# Altium schematic sheet Power.SchDoc
size A3; DocumentNumber: 7; SheetNumber: 7
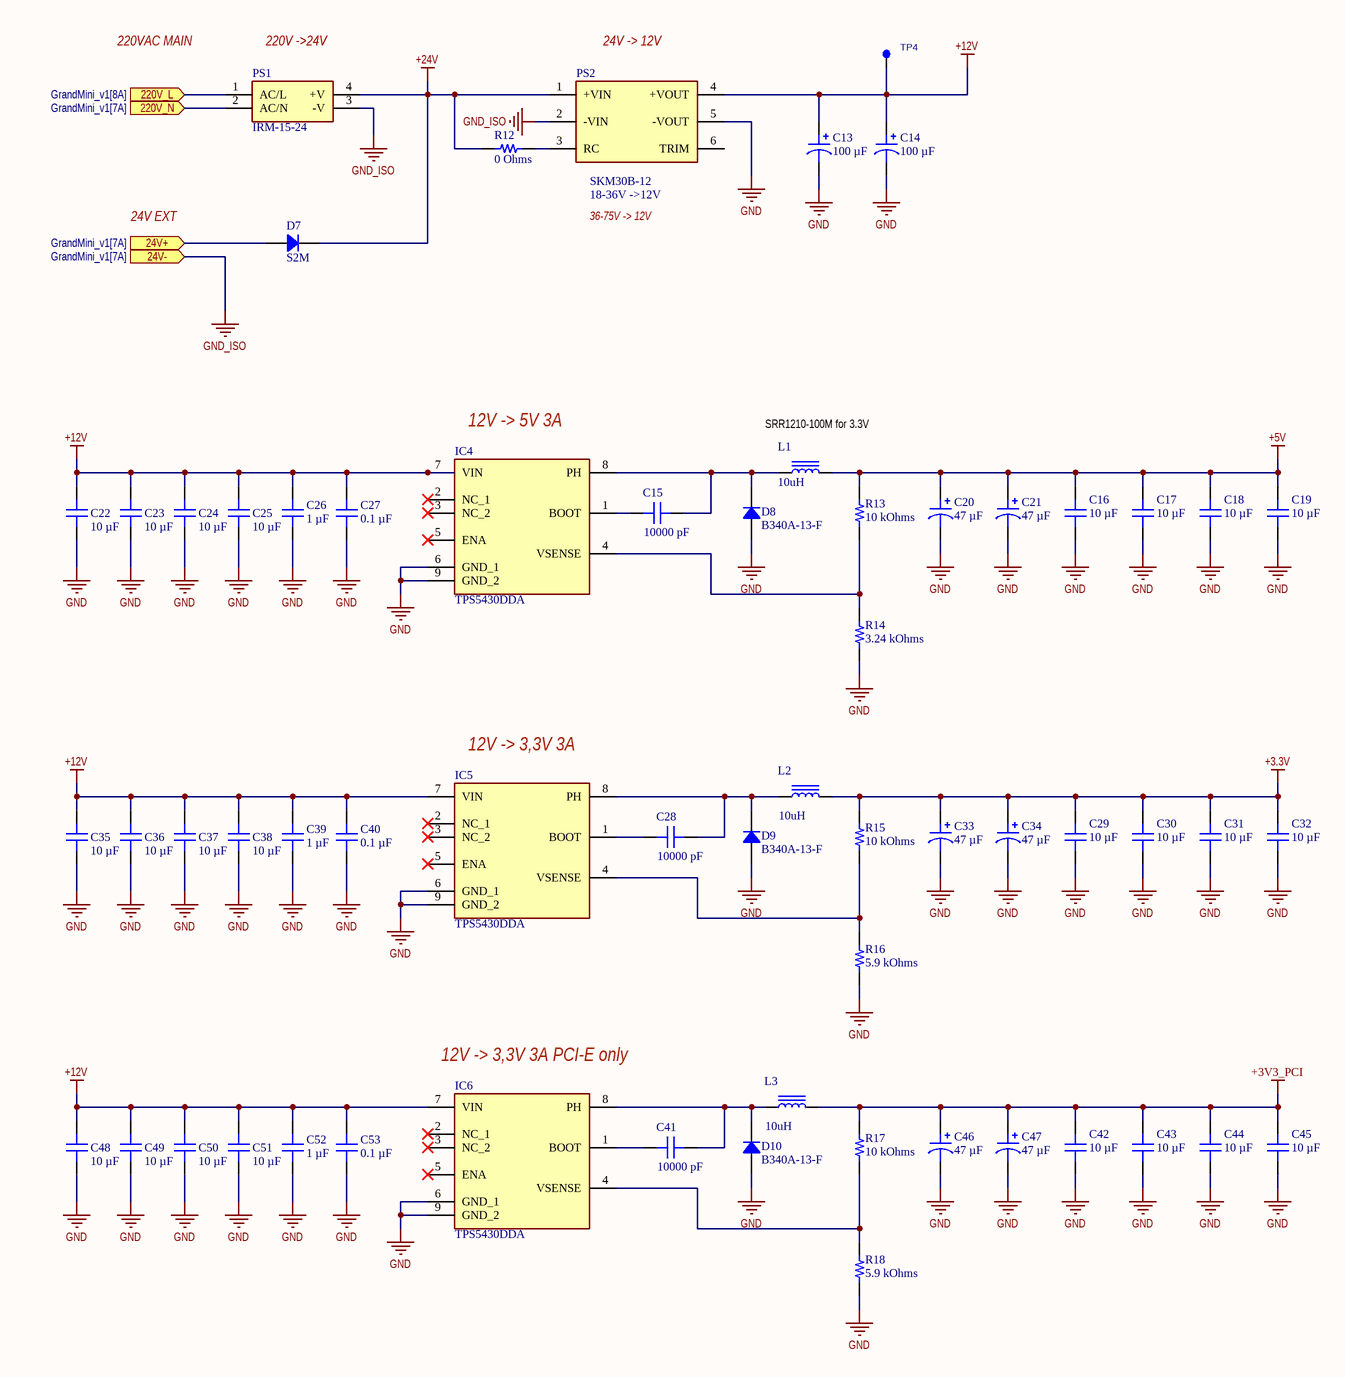
[diagram p0: Power.SchDoc]

## Parts
C13  100 µF  [CAP ALSMD 8.3MM H10.5MM]
C14  100 µF  [CAP ALSMD 8.3MM H10.5MM]
C15  10000 pF  [CAP 0603_1608]
C16  10 µF  [CAP 0805_2012]
C17  10 µF  [CAP 0805_2012]
C18  10 µF  [CAP 0805_2012]
C19  10 µF  [CAP 0805_2012]
C20  47 µF  [CAP POL 2917_7343]
C21  47 µF  [CAP POL 2917_7343]
C22  10 µF  [CAP 0805_2012]
C23  10 µF  [CAP 0805_2012]
C24  10 µF  [CAP 0805_2012]
C25  10 µF  [CAP 0805_2012]
C26  1 µF  [CAP 0603_1608]
C27  0.1 µF  [CAP 0603_1608]
C28  10000 pF  [CAP 0603_1608]
C29  10 µF  [CAP 0805_2012]
C30  10 µF  [CAP 0805_2012]
C31  10 µF  [CAP 0805_2012]
C32  10 µF  [CAP 0805_2012]
C33  47 µF  [CAP POL 2917_7343]
C34  47 µF  [CAP POL 2917_7343]
C35  10 µF  [CAP 0805_2012]
C36  10 µF  [CAP 0805_2012]
C37  10 µF  [CAP 0805_2012]
C38  10 µF  [CAP 0805_2012]
C39  1 µF  [CAP 0603_1608]
C40  0.1 µF  [CAP 0603_1608]
C41  10000 pF  [CAP 0603_1608]
C42  10 µF  [CAP 0805_2012]
C43  10 µF  [CAP 0805_2012]
C44  10 µF  [CAP 0805_2012]
C45  10 µF  [CAP 0805_2012]
C46  47 µF  [CAP POL 2917_7343]
C47  47 µF  [CAP POL 2917_7343]
C48  10 µF  [CAP 0805_2012]
C49  10 µF  [CAP 0805_2012]
C50  10 µF  [CAP 0805_2012]
C51  10 µF  [CAP 0805_2012]
C52  1 µF  [CAP 0603_1608]
C53  0.1 µF  [CAP 0603_1608]
D7  S2M  [DO214AA SMB]
D8  B340A-13-F  [DO214AC SMA]
D9  B340A-13-F  [DO214AC SMA]
D10  B340A-13-F  [DO214AC SMA]
IC4  TPS5430DDA  [SOIC127P600X170-9N]
IC5  TPS5430DDA  [SOIC127P600X170-9N]
IC6  TPS5430DDA  [SOIC127P600X170-9N]
L1  10uH  [XAL6060-103MEB]
L2  10uH  [XAL6060-103MEB]
L3  10uH  [XAL6060-103MEB]
PS1  IRM-15-24  [IRM-15]
PS2  18-36V ->12V  [SKM30]
R12  0 Ohms  [YAGEO RES 0603_1608]
R13  10 kOhms  [YAGEO RES 0603_1608]
R14  3.24 kOhms  [YAGEO RES 0603_1608]
R15  10 kOhms  [YAGEO RES 0603_1608]
R16  5.9 kOhms  [YAGEO RES 0603_1608]
R17  10 kOhms  [YAGEO RES 0603_1608]
R18  5.9 kOhms  [YAGEO RES 0603_1608]
TP4  PAD_TEST  [PAD_TEST]  (value not drawn)  (no BOM)

## Ports
24V+ (in, see GrandMini_v1[7A]), 24V- (in, see GrandMini_v1[7A]), 220V_L (in, see GrandMini_v1[8A]), 220V_N (in, see GrandMini_v1[7A])

## Nets
+3.3V: C29.2 C30.2 C31.2 C32.2 C33.1 C34.1 L2.2 R15.2
+3V3_PCI: C42.2 C43.2 C44.2 C45.2 C46.1 C47.1 L3.2 R17.2
+5V: C16.2 C17.2 C18.2 C19.2 C20.1 C21.1 L1.2 R13.2
+12V: C13.1 C14.1 C22.2 C23.2 C24.2 C25.2 C26.2 C27.2 C35.2 C36.2 C37.2 C38.2 C39.2 C40.2 C48.2 C49.2 C50.2 C51.2 C52.2 C53.2 IC4.7(VIN) IC5.7(VIN) IC6.7(VIN) PS2.4(+VOUT) TP4.1
+24V: D7.2 PS1.4(+V) PS2.1(+VIN) R12.1
GND: C13.2 C14.2 C16.1 C17.1 C18.1 C19.1 C20.2 C21.2 C22.1 C23.1 C24.1 C25.1 C26.1 C27.1 C29.1 C30.1 C31.1 C32.1 C33.2 C34.2 C35.1 C36.1 C37.1 C38.1 C39.1 C40.1 C42.1 C43.1 C44.1 C45.1 C46.2 C47.2 C48.1 C49.1 C50.1 C51.1 C52.1 C53.1 D8.1 D9.1 D10.1 IC4.6(GND_1) IC4.9(GND_2) IC5.6(GND_1) IC5.9(GND_2) IC6.6(GND_1) IC6.9(GND_2) PS2.5(-VOUT) R14.1 R16.1 R18.1
GND_ISO: PS1.3(-V) PS2.2(-VIN) ; port 24V-
24V+: D7.1 ; port 24V+
220V_L: PS1.1(AC/L) ; port 220V_L
220V_N: PS1.2(AC/N) ; port 220V_N
NetC15_1: C15.1 D8.2 IC4.8(PH) L1.1
NetC15_2: C15.2 IC4.1(BOOT)
NetC28_1: C28.1 D9.2 IC5.8(PH) L2.1
NetC28_2: C28.2 IC5.1(BOOT)
NetC41_1: C41.1 D10.2 IC6.8(PH) L3.1
NetC41_2: C41.2 IC6.1(BOOT)
NetIC4_4: IC4.4(VSENSE) R13.1 R14.2
NetIC5_4: IC5.4(VSENSE) R15.1 R16.2
NetIC6_4: IC6.4(VSENSE) R17.1 R18.2
NetPS2_3: PS2.3(RC) R12.2

Not connected (* = marked no-connect by the designer): IC4 2(NC_1)* 3(NC_2)* 5(ENA)*; IC5 2(NC_1)* 3(NC_2)* 5(ENA)*; IC6 2(NC_1)* 3(NC_2)* 5(ENA)*; PS2 6(TRIM)

## Notes on the sheet
- 220VAC MAIN
- (near PS1) 220V ->24V
- (near PS2) 24V -> 12V
- 24V EXT
- 36-75V -> 12V
- (near IC4) 12V -> 5V 3A
- (near L1) SRR1210-100M for 3.3V
- (near IC5) 12V -> 3,3V 3A
- (near IC6) 12V -> 3,3V 3A PCI-E only
- 1
- 2
- 3
- 4
- 5
- 6
- A
- B
- C
- www.raspberrypi.com <http://www.raspberrypi.com>
- D
- Title: Compute Module 4 IO Board - PSUs
- File: PSUs.kicad_sch
- Sheet: /
- © 2020-2022 Raspberry Pi Ltd (formerly Raspberry Pi (Trading) Ltd.)
- KiCad E.D.A.  kicad (5.1.4)-1
- Size: A4
- Date:
- Rev:
- Id: 1/1

## Library data of the parts
C13 C14 = EEE-FP1V101AL: CAP ALUM 100UF 20% 35V SMD; manufacturer: Panasonic Electronic Components; ESR (Equivalent Series Resistance): 80mOhm @ 100kHz; Lifetime @ Temp.: 2000 Hrs @ 105°C; Polarization: Polar; Ripple Current @ High Frequency: 850 mA @ 100 kHz; Ripple Current @ Low Frequency: 552.5 mA @ 120 Hz; Surface Mount Land Size: 0.327" L x 0.327" W (8.30mm x 8.30mm); Part Number: EEE-FP1V101AL; Applications: Automotive; Capacitance: 100 µF; componentlink1description: Datasheet; componentlink1url: https://na.industrial.panasonic.com/file-download/19633; componentlink2description: DigiKey Link; componentlink2url: https://www.digikey.com/en/products/detail/panasonic-electronic-components/EEE-FP1V101AL/12459641; Height - Seated (Max): 0.413" (10.50mm); lastupdated: 03.06.2024 20:15:43; Lifecycle Status: Active; Minimum Order: 1; Mounting Type: Surface Mount; Operating Temperature: -55°C ~ 105°C; packaging: TapeAndReel; partid: 27835; Part Status: Active; price: 0.28; Ratings: AEC-Q200; series: FP, Halogen Free; Size / Dimension: 0.315" Dia (8.00mm); Supplier 1: DigiKey; Supplier Part Number 1: 10-EEE-FP1V101ALCT-ND; Tolerance: ±20%; value: 100 µF; Voltage - Rated: 35 V
C15 C28 C41 = CC0603JRX7R9BB103: CAP CER 10000PF 50V X7R 0603; manufacturer: Yageo; Tolerance: ±5%; Supplier 1: DigiKey; Capacitance: 10000 pF; packaging: TapeAndReel; componentlink1url: https://www.yageo.com/upload/media/product/productsearch/datasheet/mlcc/UPY-GPHC_X7R_6.3V-to-50V_18.pdf; componentlink1description: Datasheet; componentlink2url: https://www.digikey.com/en/products/detail/yageo/CC0603JRX7R9BB103/5195187; componentlink2description: DigiKey Link; Supplier Part Number 1: 311-1778-1-ND; Part Number: CC0603JRX7R9BB103; Value: 10000 pF; Applications: General Purpose; Device Package: 0603 (1608 Metric); lastupdated: 09.02.2024 20:10:26; Lifecycle Status: Active; Minimum Order: 1; Mounting Type: Surface Mount, MLCC; Operating Temperature: -55°C ~ 125°C; Package / Case: 0603 (1608 Metric); partid: 5230; Part Status: Active; price: 0.01; series: CC; Size / Dimension: 0.063" L x 0.031" W (1.60mm x 0.80mm); Temperature Coefficient: X7R; Thickness (Max): 0.035" (0.90mm); Voltage - Rated: 50V
C16-C19 C22-C25 C29-C32 C35-C38 C42-C45 C48-C51 = CC0805KKX5R8BB106: CAP CER 10UF 25V X5R 0805; manufacturer: Yageo; Tolerance: ±10%; Value: 10 µF; Part Number: CC0805KKX5R8BB106; Applications: General Purpose; Capacitance: 10 µF; componentlink1description: Datasheet; componentlink1url: https://www.yageo.com/upload/media/product/productsearch/datasheet/mlcc/UPY-GPHC_X5R_4V-to-50V_25.pdf; componentlink2description: DigiKey Link; componentlink2url: https://www.digikey.com/en/products/detail/yageo/CC0805KKX5R8BB106/5195275; Device Package: 0805 (2012 Metric); lastupdated: 09.02.2024 20:15:28; Lifecycle Status: Active; Minimum Order: 1; Mounting Type: Surface Mount, MLCC; Operating Temperature: -55°C ~ 85°C; Package / Case: 0805 (2012 Metric); packaging: TapeAndReel; partid: 16151; Part Status: Active; price: 0.06; series: CC; Size / Dimension: 0.079" L x 0.049" W (2.00mm x 1.25mm); Supplier 1: DigiKey; Supplier Part Number 1: 311-1869-1-ND; Temperature Coefficient: X5R; Thickness (Max): 0.057" (1.45mm); Voltage - Rated: 25V
C20 C21 C33 C34 C46 C47 = T491X476K035AT: CAP TANT 47UF 10% 35V 2917; manufacturer: KEMET; Manufacturer Size Code: X; ESR (Equivalent Series Resistance): 600mOhm; Lifetime @ Temp.: 2000 Hrs @ 125°C; Type: Molded; Part Number: T491X476K035AT; Value: 47 µF; Capacitance: 47 µF; componentlink1description: Datasheet; componentlink1url: https://api.kemet.com/component-edge/download/datasheet/T491X476K035AT.pdf; componentlink2description: DigiKey Link; componentlink2url: https://www.digikey.com/en/products/detail/kemet/T491X476K035AT/818681; Device Package: 2917 (7343 Metric); Features: General Purpose; Height - Seated (Max): 0.169" (4.30mm); lastupdated: 03.06.2024 19:30:20; Lifecycle Status: Active; Minimum Order: 1; Mounting Type: Surface Mount; Operating Temperature: -55°C ~ 125°C; Package / Case: 2917 (7343 Metric); packaging: TapeAndReel; partid: 3168; Part Status: Active; price: 1.10; series: T491; Size / Dimension: 0.287" L x 0.169" W (7.30mm x 4.30mm); Supplier 1: DigiKey; Supplier Part Number 1: 399-3821-1-ND; Tolerance: ±10%; Voltage - Rated: 35 V
C26 C39 C52 = CC0603KRX7R9BB105: CAP CER 1UF 50V X7R 0603; manufacturer: Yageo; Tolerance: ±10%; Part Number: CC0603KRX7R9BB105; Value: 1 µF; Applications: General Purpose; Capacitance: 1 µF; componentlink1description: Datasheet; componentlink1url: https://www.yageo.com/upload/media/product/productsearch/datasheet/mlcc/UPY-GPHC_X7R_6.3V-to-50V_20.pdf; componentlink2description: DigiKey Link; componentlink2url: https://www.digikey.com/en/products/detail/yageo/CC0603KRX7R9BB105/5883796; Device Package: 0603 (1608 Metric); lastupdated: 09.02.2024 20:09:49; Lifecycle Status: Active; Minimum Order: 1; Mounting Type: Surface Mount, MLCC; Operating Temperature: -55°C ~ 125°C; Package / Case: 0603 (1608 Metric); packaging: TapeAndReel; partid: 45844; Part Status: Active; price: 0.09; series: CC; Size / Dimension: 0.063" L x 0.031" W (1.60mm x 0.80mm); Supplier 1: DigiKey; Supplier Part Number 1: 311-2082-1-ND; Temperature Coefficient: X7R; Thickness (Max): 0.035" (0.90mm); Voltage - Rated: 50V
C27 C40 C53 = CC0603KRX7R9BB104: CAP CER 0.1UF 50V X7R 0603; manufacturer: Yageo; Tolerance: ±10%; Part Number: CC0603KRX7R9BB104; Value: 0.1 µF; Applications: General Purpose; Capacitance: 0.1 µF; componentlink1description: Datasheet; componentlink1url: https://www.yageo.com/upload/media/product/productsearch/datasheet/mlcc/UPY-GPHC_X7R_6.3V-to-50V_18.pdf; componentlink2description: DigiKey Link; componentlink2url: https://www.digikey.com/en/products/detail/yageo/CC0603KRX7R9BB104/2103082; Device Package: 0603 (1608 Metric); lastupdated: 09.02.2024 20:10:21; Lifecycle Status: Active; Minimum Order: 1; Mounting Type: Surface Mount, MLCC; Operating Temperature: -55°C ~ 125°C; Package / Case: 0603 (1608 Metric); packaging: TapeAndReel; partid: 9506; Part Status: Active; price: 0.01; series: CC; Size / Dimension: 0.063" L x 0.031" W (1.60mm x 0.80mm); Supplier 1: DigiKey; Supplier Part Number 1: 311-1344-1-ND; Temperature Coefficient: X7R; Thickness (Max): 0.035" (0.90mm); Voltage - Rated: 50V
D7 = S2M: DIODE GEN PURP 1KV 2A DO214AA; Manufacturer: ON Semiconductor; Capacitance @ Vr, F: 30pF @ 4V, 1MHz; Current - Reverse Leakage @ Vr: 1µA @ 1000V; Diode Type: Standard; Reverse Recovery Time (trr): 2µs; Speed: Standard Recovery >500ns, > 200mA (Io); Voltage - DC Reverse (Vr) (Max): 1000V; Voltage - Forward (Vf) (Max) @ If: 1.15V @ 2A; Part Number: S2M; ComponentLink1Description: Datasheet; ComponentLink1URL: https://www.onsemi.com/pub/Collateral/S2M-D.pdf; ComponentLink2Description: DigiKey Link; ComponentLink2URL: http://digikey.com/product-detail/en/on-semiconductor/S2M/S2MFSCT-ND/2094442; Current - Average Rectified (Io): 2A; LastUpdated: 03.06.2024 19:53:56; Lifecycle Status: Active; Minimum Order: 1; Mounting Type: Surface Mount; Operating Temperature - Junction: -65°C ~ 150°C; Package / Case: DO-214AA, SMB; Packaging: TapeAndReel; PartId: 299; Part Status: Active; Price: 0.06; Series: -; Supplier 1: DigiKey; Supplier Part Number 1: S2MFSCT-ND; Supplier Device Package: DO-214AA (SMB)
D8-D10 = B340A-13-F: DIODE SCHOTTKY 40V 3A SMA; Manufacturer: Diodes Incorporated; Current - Reverse Leakage @ Vr: 500 µA @ 40 V; Speed: Fast Recovery =< 500ns, > 200mA (Io); Voltage - Forward (Vf) (Max) @ If: 500 mV @ 3 A; Capacitance @ Vr, F: 200pF @ 4V, 1MHz; Part Number: B340A-13-F; ComponentLink1Description: Datasheet; ComponentLink1URL: https://www.diodes.com/assets/Datasheets/ds30891.pdf; ComponentLink2Description: DigiKey Link; ComponentLink2URL: https://www.digikey.com/en/products/detail/diodes-incorporated/B340A-13-F/725015; Current - Average Rectified (Io): 3A; Diode Type: Schottky; LastUpdated: 03.06.2024 19:54:36; Lifecycle Status: Active; Minimum Order: 1; Mounting Type: Surface Mount; Operating Temperature - Junction: -55°C ~ 150°C; Package / Case: DO-214AC, SMA; Packaging: TapeAndReel; PartId: 1873; Part Status: Active; Price: 0.09; Series: -; Supplier 1: DigiKey; Supplier Part Number 1: B340A-FDICT-ND; Supplier Device Package: SMA; Voltage - DC Reverse (Vr) (Max): 40 V
IC4-IC6 = TPS5430DDA: Integrated Circuit; Manufacturer_Name: Texas Instruments; Datasheet Link: https://datasheet.datasheetarchive.com/originals/distributors/Datasheets-SFU2/DSASFU100034215.pdf; Height: 1.7mm; Manufacturer_Part_Number: TPS5430DDA; Mouser Part Number: 595-TPS5430DDA; Mouser Price/Stock: https://www.mouser.co.uk/ProductDetail/Texas-Instruments/TPS5430DDA?qs=zwk82MlA57bk5fOPRvfoCA%3D%3D; Arrow Part Number: TPS5430DDA; Arrow Price/Stock: https://www.arrow.com/en/products/tps5430dda/texas-instruments?region=nac
L1-L3 = XAL6060-103MEB: SMT Inductor; Value: 10uH
PS1 = IRM-15-24: Power Supply; Manufacturer_Name: Mean Well; Datasheet Link: https://componentsearchengine.com/Datasheets/2/IRM-15-24.pdf; Manufacturer_Part_Number: IRM-15-24; Mouser Part Number: 709-IRM15-24; Mouser Price/Stock: https://www.mouser.co.uk/ProductDetail/MEAN-WELL/IRM-15-24?qs=WkdRfq4wf1PZSEWhZtKDbQ%3D%3D; Arrow Part Number: IRM-15-24; Arrow Price/Stock: https://www.arrow.com/en/products/irm-15-24/mean-well-enterprises?utm_currency=USD&region=europe
PS2 = SKM30B-12: DC/DC, 30Вт, Uвх: 18-36В, Uвых: 12ВDC, Iвых: 2,5А / A: 9 ~ 18VDC B: 18 ~ 36VDC C: 36 ~ 75VDC; Manufacturer_Name: Mean Well; Datasheet Link: https://static.chipdip.ru/lib/784/DOC059784426.pdf; Height: 12; Manufacturer_Part_Number: SKM30B-12; Mouser Part Number: 709-DPU01N-12; Mouser Price/Stock: https://www.mouser.co.uk/ProductDetail/MEAN-WELL/DPU01N-12?qs=5aG0NVq1C4yTyMl3DWRvqA%3D%3D; Arrow Part Number: DPU01N-12; Arrow Price/Stock: https://www.arrow.com/en/products/dpu01n-12/mean-well-enterprises
R12 = RC0603FR-070RL: RES 0 OHM JUMPER 1/10W 0603; Manufacturer: Yageo; Power (Watts): 0.1W, 1/10W; Part Number: RC0603FR-070RL; Value: 0 Ohms; ComponentLink1Description: Datasheet; ComponentLink1URL: https://www.yageo.com/upload/media/product/productsearch/datasheet/rchip/PYu-RC_Group_51_RoHS_L_10.pdf; ComponentLink2Description: DigiKey Link; ComponentLink2URL: https://www.digikey.com/en/products/detail/yageo/RC0603FR-070RL/1304008; Composition: Thick Film; Device Package: 0603 (1608 Metric); Features: Moisture Resistant; Height - Seated (Max): 0.022" (0.55mm); LastUpdated: 25.07.2024 9:19:19; Lifecycle Status: Active; Minimum Order: 1; Number of Terminations: 2; Operating Temperature: -55°C ~ 155°C; Package / Case: 0603 (1608 Metric); Packaging: CutTape; PartId: 22614; Part Status: Active; Price: 0.01; Resistance: 0 Ohms; Series: RC_L; Size / Dimension: 0.063" L x 0.031" W (1.60mm x 0.80mm); Supplier 1: DigiKey; Supplier Part Number 1: 311-0.0HRCT-ND; Supplier Device Package: 0603; Tolerance: Jumper
R13 R15 R17 = RC0603FR-0710KL: RES 10K OHM 1% 1/10W 0603; Manufacturer: Yageo; Power (Watts): 0.1W, 1/10W; Temperature Coefficient: ±100ppm/°C; Part Number: RC0603FR-0710KL; Value: 10 kOhms; ComponentLink1Description: Datasheet; ComponentLink1URL: https://www.yageo.com/upload/media/product/productsearch/datasheet/rchip/PYu-RC_Group_51_RoHS_L_10.pdf; ComponentLink2Description: DigiKey Link; ComponentLink2URL: https://www.digikey.com/en/products/detail/yageo/RC0603FR-0710KL/726880; Composition: Thick Film; Device Package: 0603 (1608 Metric); Features: Moisture Resistant; Height - Seated (Max): 0.022" (0.55mm); LastUpdated: 25.07.2024 9:19:19; Lifecycle Status: Active; Minimum Order: 1; Number of Terminations: 2; Operating Temperature: -55°C ~ 155°C; Package / Case: 0603 (1608 Metric); Packaging: CutTape; PartId: 22599; Part Status: Active; Price: 0.01; Resistance: 10 kOhms; Series: RC_L; Size / Dimension: 0.063" L x 0.031" W (1.60mm x 0.80mm); Supplier 1: DigiKey; Supplier Part Number 1: 311-10.0KHRCT-ND; Supplier Device Package: 0603; Tolerance: ±1%
R14 = RC0603FR-073K24L: RES 3.24K OHM 1% 1/10W 0603; Manufacturer: Yageo; Power (Watts): 0.1W, 1/10W; Temperature Coefficient: ±100ppm/°C; Part Number: RC0603FR-073K24L; Value: 3.24 kOhms; ComponentLink1Description: Datasheet; ComponentLink1URL: https://www.yageo.com/upload/media/product/productsearch/datasheet/rchip/PYu-RC_Group_51_RoHS_L_10.pdf; ComponentLink2Description: DigiKey Link; ComponentLink2URL: https://www.digikey.com/en/products/detail/yageo/RC0603FR-073K24L/727125; Composition: Thick Film; Device Package: 0603 (1608 Metric); Features: Moisture Resistant; Height - Seated (Max): 0.022" (0.55mm); LastUpdated: 25.07.2024 9:19:27; Lifecycle Status: Active; Minimum Order: 1; Number of Terminations: 2; Operating Temperature: -55°C ~ 155°C; Package / Case: 0603 (1608 Metric); Packaging: CutTape; PartId: 12479; Part Status: Active; Price: 0.01; Resistance: 3.24 kOhms; Series: RC_L; Size / Dimension: 0.063" L x 0.031" W (1.60mm x 0.80mm); Supplier 1: DigiKey; Supplier Part Number 1: 311-3.24KHRCT-ND; Supplier Device Package: 0603; Tolerance: ±1%
R16 R18 = RC0603FR-075K9L: RES 5.9K OHM 1% 1/10W 0603; Manufacturer: Yageo; Power (Watts): 0.1W, 1/10W; Temperature Coefficient: ±100ppm/°C; Part Number: RC0603FR-075K9L; Value: 5.9 kOhms; ComponentLink1Description: Datasheet; ComponentLink1URL: https://www.yageo.com/upload/media/product/productsearch/datasheet/rchip/PYu-RC_Group_51_RoHS_L_10.pdf; ComponentLink2Description: DigiKey Link; ComponentLink2URL: https://www.digikey.com/en/products/detail/yageo/RC0603FR-075K9L/727280; Composition: Thick Film; Device Package: 0603 (1608 Metric); Features: Moisture Resistant; Height - Seated (Max): 0.022" (0.55mm); LastUpdated: 25.07.2024 9:19:27; Lifecycle Status: Active; Minimum Order: 1; Number of Terminations: 2; Operating Temperature: -55°C ~ 155°C; Package / Case: 0603 (1608 Metric); Packaging: CutTape; PartId: 12481; Part Status: Active; Price: 0.01; Resistance: 5.9 kOhms; Series: RC_L; Size / Dimension: 0.063" L x 0.031" W (1.60mm x 0.80mm); Supplier 1: DigiKey; Supplier Part Number 1: 311-5.90KHRCT-ND; Supplier Device Package: 0603; Tolerance: ±1%
TP4 = PAD_TEST: Test Point; Manufacturer: {Manufacturer}; Reseller3: {Reseller3}; Reseller1: {Reseller1}; Tempcoeff: {Tempcoeff}; Reseller2: {Reseller2}; Tolerance: {Tolerance}; Value: .NetName; PowerVoltage: {PowerVoltage}; CatalogueCode: {CatalogueCode}; Case: {Case}